# EAGLE design M106A (EAGLE 6.6.0)
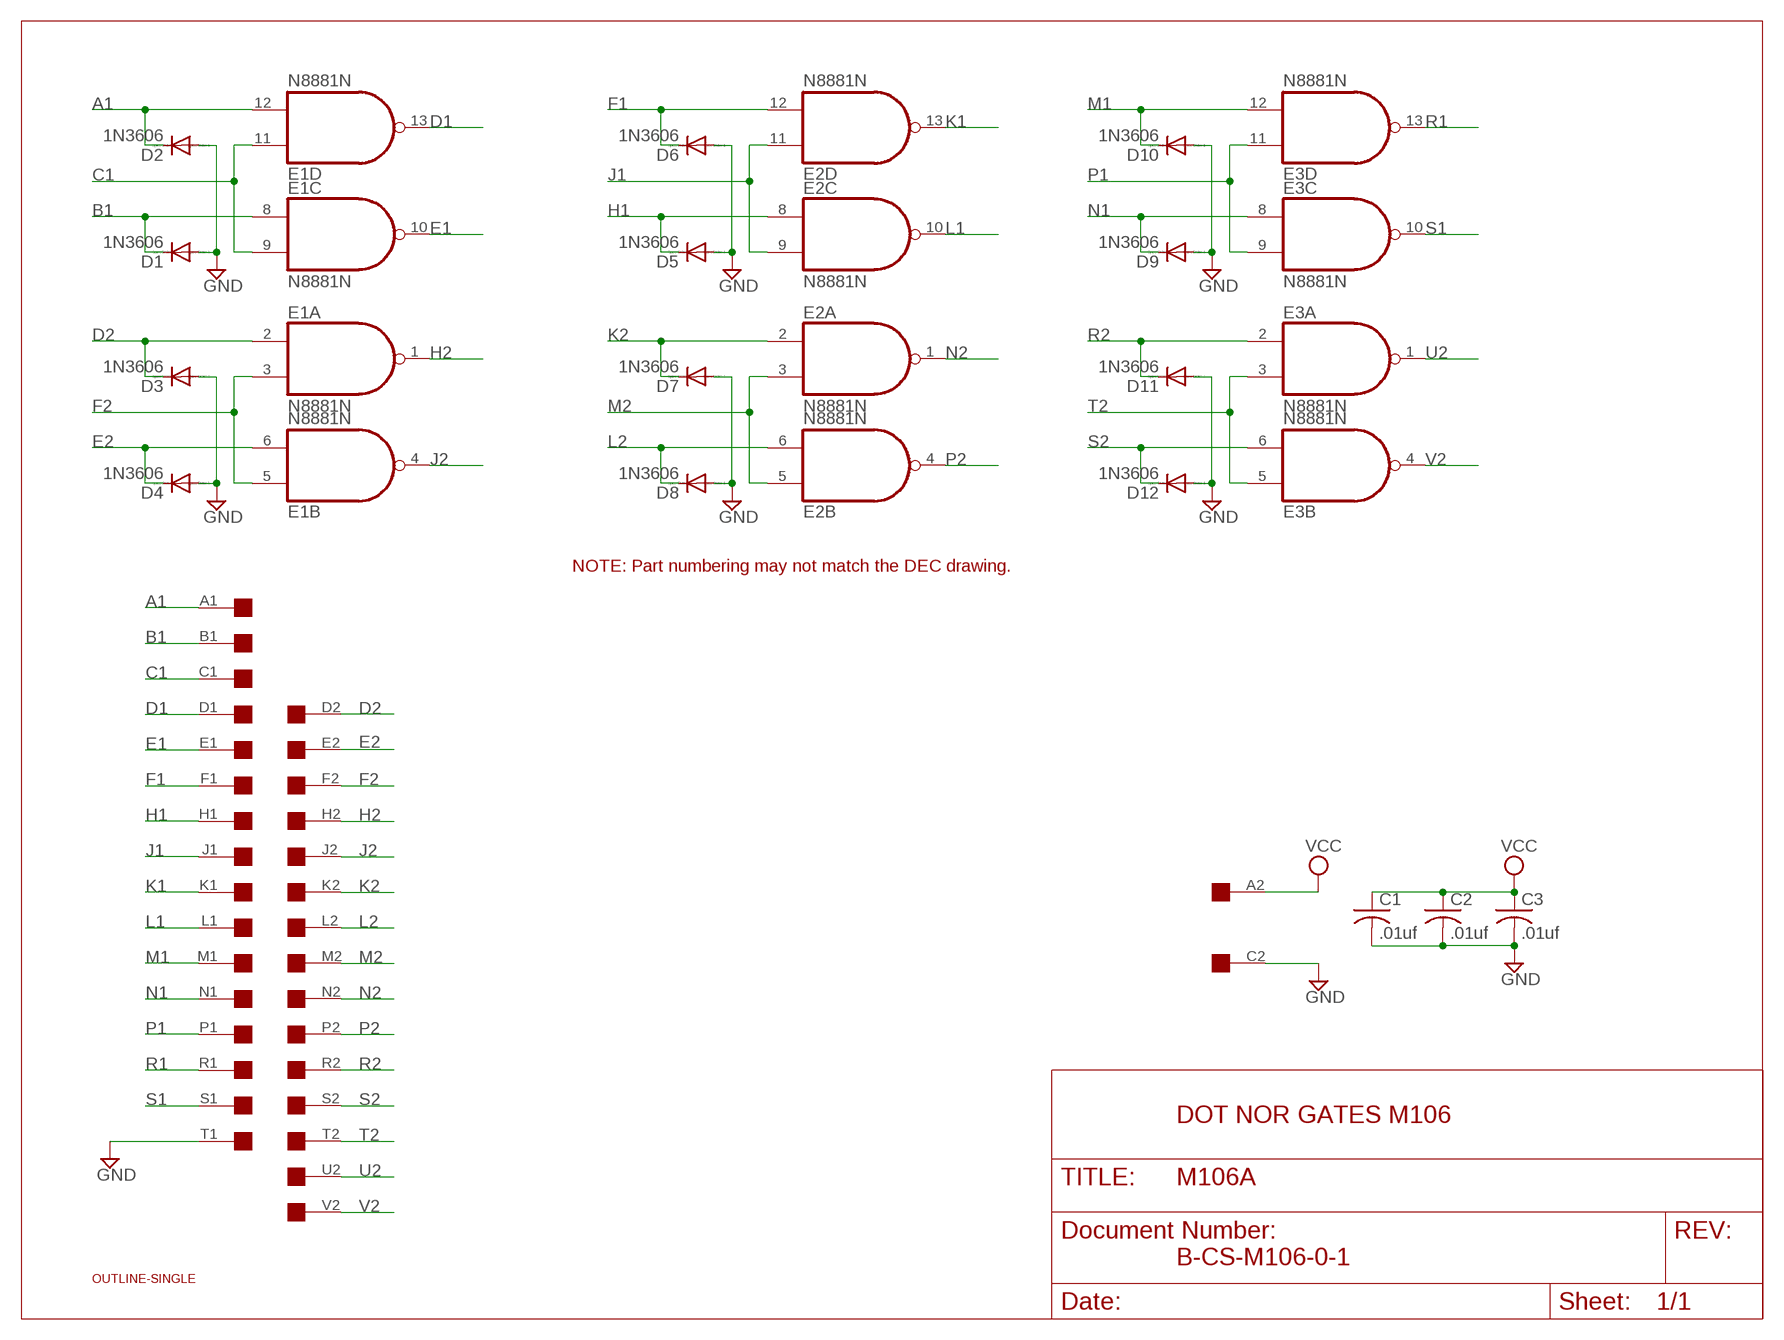
[diagram p0: schematic, sheet 1]

## Parts
C1  .01uf  C-US050-025X075  [C050-025X075]
C2  .01uf  C-US050-025X075  [C050-025X075]
C3  .01uf  C-US050-025X075  [C050-025X075]
D1  1N3606  1N4148DO35-10  [DO35-10]
D2  1N3606  1N4148DO35-10  [DO35-10]
D3  1N3606  1N4148DO35-10  [DO35-10]
D4  1N3606  1N4148DO35-10  [DO35-10]
D5  1N3606  1N4148DO35-10  [DO35-10]
D6  1N3606  1N4148DO35-10  [DO35-10]
D7  1N3606  1N4148DO35-10  [DO35-10]
D8  1N3606  1N4148DO35-10  [DO35-10]
D9  1N3606  1N4148DO35-10  [DO35-10]
D10  1N3606  1N4148DO35-10  [DO35-10]
D11  1N3606  1N4148DO35-10  [DO35-10]
D12  1N3606  1N4148DO35-10  [DO35-10]
E1  N8881N  [DIL14]
E2  N8881N  [DIL14]
E3  N8881N  [DIL14]
U$1  SINGLE  [EDGE-CON2]
U$4  OUTLINE-SINGLE  [SINGLE]

## Nets
A1: D2.C E1.12(D:I1) U$1.A1
B1: D1.C E1.8(C:I0) U$1.B1
C1: E1.9(C:I1) E1.11(D:I0) U$1.C1
D1: E1.13(D:O) U$1.D1
D2: D3.C E1.2(A:I0) U$1.D2
E1: E1.10(C:O) U$1.E1
E2: D4.C E1.6(B:I1) U$1.E2
F1: D6.C E2.12(D:I1) U$1.F1
F2: E1.3(A:I1) E1.5(B:I0) U$1.F2
GND [Supply]: C1.2 C2.2 C3.2 D1.A D2.A D3.A D4.A D5.A D6.A D7.A D8.A D9.A D10.A D11.A D12.A U$1.C2 U$1.T1
H1: D5.C E2.8(C:I0) U$1.H1
H2: E1.1(A:O) U$1.H2
J1: E2.9(C:I1) E2.11(D:I0) U$1.J1
J2: E1.4(B:O) U$1.J2
K1: E2.13(D:O) U$1.K1
K2: D7.C E2.2(A:I0) U$1.K2
L1: E2.10(C:O) U$1.L1
L2: D8.C E2.6(B:I1) U$1.L2
M1: D10.C E3.12(D:I1) U$1.M1
M2: E2.3(A:I1) E2.5(B:I0) U$1.M2
N1: D9.C E3.8(C:I0) U$1.N1
N2: E2.1(A:O) U$1.N2
P1: E3.9(C:I1) E3.11(D:I0) U$1.P1
P2: E2.4(B:O) U$1.P2
R1: E3.13(D:O) U$1.R1
R2: D11.C E3.2(A:I0) U$1.R2
S1: E3.10(C:O) U$1.S1
S2: D12.C E3.6(B:I1) U$1.S2
T2: E3.3(A:I1) E3.5(B:I0) U$1.T2
U2: E3.1(A:O) U$1.U2
V2: E3.4(B:O) U$1.V2
VCC [Supply]: C1.1 C2.1 C3.1 U$1.A2
Unconnected: U$1.B2 U$1.U1 U$1.V1

## Notes on the sheet
- NOTE: Part numbering may not match the DEC drawing.
- DOT NOR GATES M106
- B-CS-M106-0-1

## Power pins joined to a net without a drawn wire
GND: E1.7(P:GND) E2.7(P:GND) E3.7(P:GND)
VCC: E1.14(P:VCC) E2.14(P:VCC) E3.14(P:VCC)

## Library data of the parts
C1-C3 = rcl:C-US: CAPACITOR, American symbol
D1-D12 = diode:1N4148: DIODE high speed (Philips)
E1-E3 = dec-con:N8881: Quad 2-input NAND gate, open collector
U$1 = dec-con:SINGLE: Single-Height DEC board
U$4 = dec-con:OUTLINE-*: Board outlines for DEC boards.

## Net classes
1 Supply: width 0.813 mm

## Board
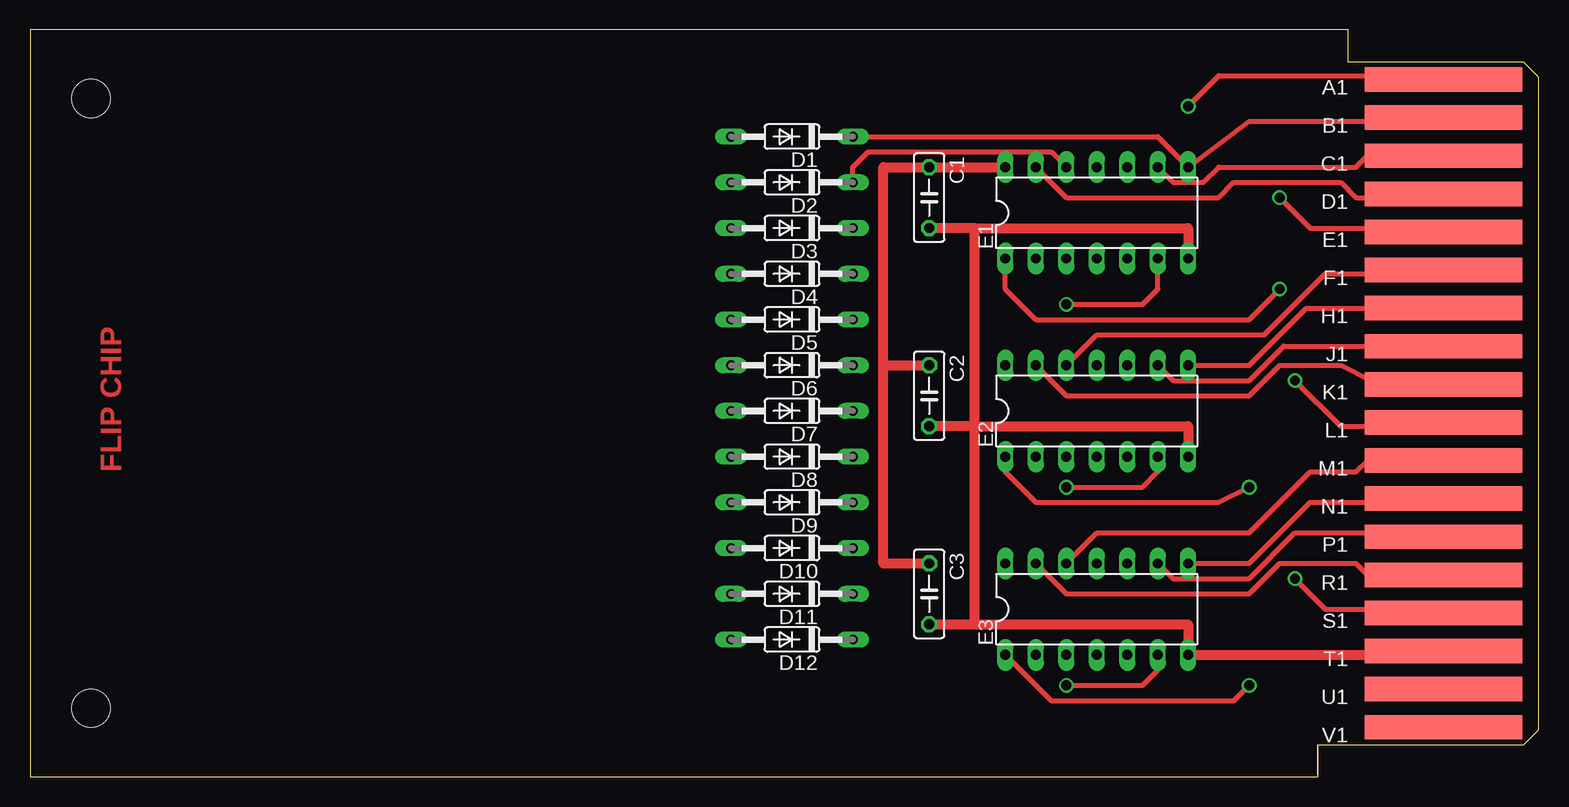
[diagram p1: board, top side]
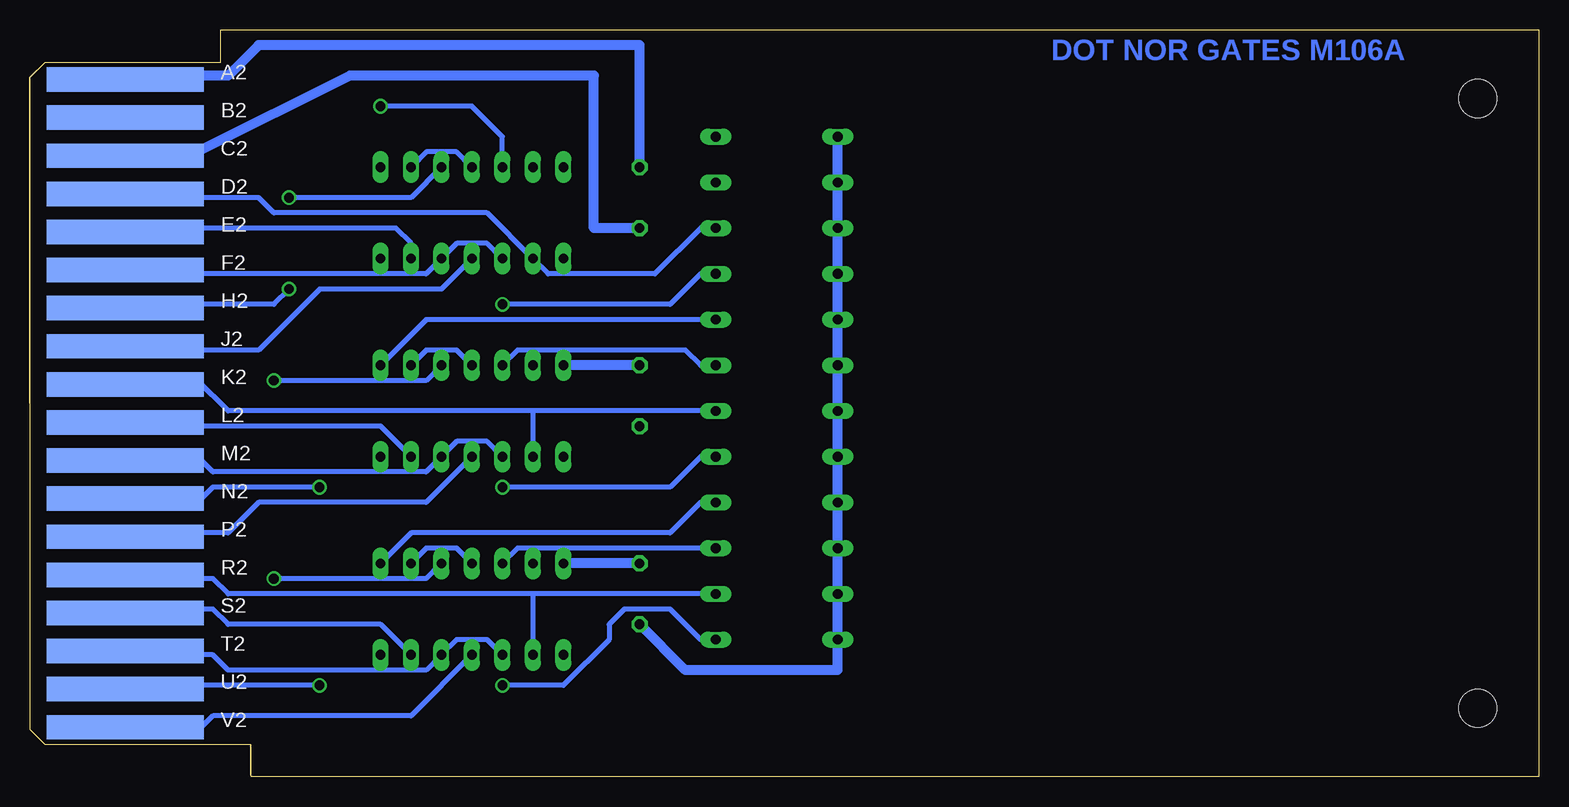
[diagram p2: board, bottom side, seen from below]

Size 125.73 x 62.23 mm. Coordinates in mm from the lower left corner, seen from the top.
Copper layers (1+16): Top 0.035mm / dielectric 1.5mm / Bottom 0.035mm
Design rules "16mils": minimum track width 16mil, minimum drill 32mil, track to track 15mil, track to pad 10mil, pad to pad 10mil, via to via 10mil, smd to smd 10mil, copper to edge 13mil, drill to drill 10mil, minimum pad ring 10mil, minimum via ring 8mil, stop-mask expansion 0mil, vias tented up to drill 0mil, thermal gap 10mil

### Footprints (pad centres in the part's own frame; a part is rotated, then mirrored left to right if it is on the bottom)
C050-025X075 = drill 0.813 octagon: 1 -2.54,0; 2 2.54,0
DO35-10 = drill 0.813 long: A 5.08,0; C -5.08,0
DIL14 = drill 0.813 long: 1 -7.62,-3.81; 2 -5.08,-3.81; 3 -2.54,-3.81; 4 0,-3.81; 5 2.54,-3.81; 6 5.08,-3.81; 7 7.62,-3.81; 8 7.62,3.81; 9 5.08,3.81; 10 2.54,3.81; 11 0,3.81; 12 -2.54,3.81; 13 -5.08,3.81; 14 -7.62,3.81
EDGE-CON2 = smd 13.106 x 2.032: A1 7.938,4.128; B1 7.938,7.303; C1 7.938,10.477; D1 7.938,13.652; E1 7.938,16.828; F1 7.938,20.003; H1 7.938,23.177; J1 7.938,26.352; K1 7.938,29.527; L1 7.938,32.703; M1 7.938,35.877; N1 7.938,39.053; P1 7.938,42.227; R1 7.938,45.403; S1 7.938,48.578; T1 7.938,51.752; U1 7.938,54.928; V1 7.938,58.102 | smd 13.106 x 2.032 bottom: A2 7.938,4.128; B2 7.938,7.303; C2 7.938,10.477; D2 7.938,13.652; E2 7.938,16.828; F2 7.938,20.003; H2 7.938,23.177; J2 7.938,26.352; K2 7.938,29.527; L2 7.938,32.703; M2 7.938,35.877; N2 7.938,39.053; P2 7.938,42.227; R2 7.938,45.403; S2 7.938,48.578; T2 7.938,51.752; U2 7.938,54.928; V2 7.938,58.102
SINGLE = hole 3.175: 120.65,56.515; 120.65,5.715

### Placement (x,y rotation side)
C1  74.93,48.26 270 top
C2  74.93,31.75 270 top
C3  74.93,15.24 270 top
D1  63.5,53.34 180 top
D2  63.5,49.53 180 top
D3  63.5,45.72 180 top
D4  63.5,41.91 180 top
D5  63.5,38.1 180 top
D6  63.5,34.29 180 top
D7  63.5,30.48 180 top
D8  63.5,26.67 180 top
D9  63.5,22.86 180 top
D10  63.5,19.05 180 top
D11  63.5,15.24 180 top
D12  63.5,11.43 180 top
E1  88.9,46.99 0 top
E2  88.9,30.48 0 top
E3  88.9,13.97 0 top
U$1  125.73,62.23 180 top
U$4  125.73,62.23 180 top

### Tracks (layer width: path | path; a pad name or v marks a point on that pad's centre or on a via)
A1  (via drill 0.81)
  Top 0.406: D2.C 68.58,50.8 69.85,52.07 85.09,52.07 E1.12 | U$1.A1 112.16,58.02 111.76,58.42 99.06,58.42 v96.52,55.88
  Bottom 0.406: E1.12 86.36,53.34 88.9,55.88 v96.52,55.88
B1
  Top 0.406: D1.C 93.98,53.34 E1.8 101.6,54.61 111.76,54.61 112.74,54.9 U$1.B1
C1
  Top 0.406: U$1.C1 111.43,51.74 110.49,50.8 99.06,50.8 97.79,49.53 95.25,49.53 E1.9
  Bottom 0.406: E1.11 90.17,52.07 92.71,52.07 E1.9
D1
  Top 0.406: U$1.D1 112.06,48.56 111.76,48.26 110.49,48.26 109.22,49.53 100.33,49.53 99.06,48.26 86.36,48.26 E1.13
D2
  Bottom 0.406: U$1.D2 112.06,48.56 111.76,48.26 106.68,48.26 105.41,46.99 87.63,46.99 E1.2 82.55,41.91 73.66,41.91 69.85,45.72 D3.C
E1  (via drill 0.81)
  Top 0.406: U$1.E1 112.09,45.39 111.76,45.72 106.68,45.72 v104.14,48.26
  Bottom 0.406: v104.14,48.26 93.98,48.26 E1.10
E2  (via drill 0.81)
  Top 0.406: E1.6 93.98,40.64 92.71,39.37 v86.36,39.37
  Bottom 0.406: E1.6 93.98,44.45 95.25,45.72 113.03,45.72 113.36,45.39 U$1.E2 | D4.C 69.85,41.91 72.39,39.37 v86.36,39.37
F1
  Top 0.406: U$1.F1 112.04,42.19 111.76,41.91 107.95,41.91 102.87,36.83 88.9,36.83 E2.12
  Bottom 0.406: D6.C 69.85,34.29 71.12,35.56 85.09,35.56 E2.12
F2
  Bottom 0.406: E1.3 87.63,44.45 90.17,44.45 E1.5 92.71,41.91 111.76,41.91 112.04,42.19 U$1.F2
GND
  Top 0.813: C3.2 78.74,12.7 | 78.74,12.7 78.74,29.21 | 78.74,29.21 78.74,45.72 | 78.74,45.72 C1.2 | 78.74,29.21 C2.2 | U$1.T1 112.09,10.49 111.76,10.16 E3.7 96.52,12.7 78.74,12.7 | E2.7 96.52,29.21 78.74,29.21 | E1.7 96.52,45.72 78.74,45.72
  Bottom 0.813: U$1.C2 111.76,51.74 111.76,52.07 99.06,58.42 78.74,58.42 78.74,45.72 C1.2 | C3.2 71.12,8.89 58.42,8.89 D12.A D11.A D10.A D9.A D8.A D7.A D6.A D5.A D4.A D3.A D2.A D1.A
H1
  Top 0.406: U$1.H1 106.35,39.04 101.6,34.29 E2.8
  Bottom 0.406: D5.C 92.71,38.1 E2.8
H2  (via drill 0.81)
  Top 0.406: E1.1 81.28,40.64 83.82,38.1 101.6,38.1 v104.14,40.64
  Bottom 0.406: U$1.H2 112.09,39.04 111.76,39.37 105.41,39.37 v104.14,40.64
J1
  Top 0.406: U$1.J1 104.47,35.89 101.6,33.02 95.25,33.02 E2.9
  Bottom 0.406: E2.11 90.17,35.56 92.71,35.56 E2.9
J2
  Bottom 0.406: U$1.J2 112.09,35.89 111.76,35.56 106.68,35.56 101.6,40.64 91.44,40.64 E1.4
K1
  Top 0.406: U$1.K1 112.72,32.72 111.76,33.02 109.22,34.29 104.14,34.29 101.6,31.75 86.36,31.75 E2.13
K2
  Bottom 0.406: D7.C 83.82,30.48 | 83.82,30.48 E2.2 | U$1.K2 112.72,32.72 111.76,33.02 109.22,30.48 83.82,30.48
L1  (via drill 0.81)
  Top 0.406: U$1.L1 113.03,29.21 109.22,29.21 v105.41,33.02
  Bottom 0.406: v105.41,33.02 92.71,33.02 E2.10
L2  (via drill 0.81)
  Top 0.406: E2.6 93.98,25.4 92.71,24.13 v86.36,24.13
  Bottom 0.406: v86.36,24.13 72.39,24.13 69.85,26.67 D8.C | U$1.L2 112.09,29.54 111.76,29.21 96.52,29.21 E2.6
M1
  Top 0.406: U$1.M1 111.43,26.34 110.49,25.4 106.68,25.4 101.6,20.32 88.9,20.32 E3.12
  Bottom 0.406: D10.C 85.09,19.05 E3.12
M2
  Bottom 0.406: E2.3 87.63,27.94 90.17,27.94 E2.5 92.71,25.4 110.49,25.4 111.43,26.34 U$1.M2
N1
  Top 0.406: U$1.N1 112.09,23.19 111.76,22.86 106.68,22.86 101.6,17.78 E3.8
  Bottom 0.406: D9.C 69.85,22.86 72.39,20.32 93.98,20.32 E3.8
N2  (via drill 0.81)
  Top 0.406: E2.1 81.28,25.4 83.82,22.86 99.06,22.86 v101.6,24.13
  Bottom 0.406: U$1.N2 111.43,23.19 110.49,24.13 v101.6,24.13
P1
  Top 0.406: U$1.P1 112.09,19.99 111.76,20.32 105.41,20.32 101.6,16.51 95.25,16.51 E3.9
  Bottom 0.406: E3.11 90.17,19.05 92.71,19.05 E3.9
P2
  Bottom 0.406: U$1.P2 112.09,19.99 111.76,20.32 109.22,20.32 106.68,22.86 92.71,22.86 E2.4
R1
  Top 0.406: U$1.R1 111.43,16.84 110.49,17.78 104.14,17.78 101.6,15.24 86.36,15.24 E3.13
R2
  Bottom 0.406: D11.C 83.82,15.24 | 83.82,15.24 E3.2 | 83.82,15.24 109.22,15.24 110.49,16.51 111.76,16.51 112.09,16.84 U$1.R2
S1  (via drill 0.81)
  Top 0.406: U$1.S1 112.06,13.66 111.76,13.97 107.95,13.97 v105.41,16.51
  Bottom 0.406: v105.41,16.51 92.71,16.51 E3.10
S2  (via drill 0.81)
  Top 0.406: E3.6 93.98,8.89 92.71,7.62 v86.36,7.62
  Bottom 0.406: D12.C 69.85,11.43 72.39,13.97 76.2,13.97 77.47,12.7 77.47,11.43 81.28,7.62 v86.36,7.62 | E3.6 96.52,12.7 109.22,12.7 110.49,13.97 111.76,13.97 112.06,13.66 U$1.S2
T2
  Bottom 0.406: E3.3 87.63,11.43 90.17,11.43 E3.5 92.71,8.89 109.22,8.89 110.49,10.16 111.76,10.16 112.09,10.49 U$1.T2
U2  (via drill 0.81)
  Top 0.406: E3.1 85.09,6.35 100.33,6.35 v101.6,7.62
  Bottom 0.406: U$1.U2 112.12,7.26 111.76,7.62 v101.6,7.62
V2
  Bottom 0.406: U$1.V2 111.37,4.2 110.49,5.08 93.98,5.08 E3.4
VCC
  Top 0.813: 71.12,34.29 71.12,17.78 C3.1 | 71.12,34.29 71.12,50.8 C1.1 E1.14 | 71.12,34.29 C2.1
  Bottom 0.813: U$1.A2 113.03,58.02 111.76,58.42 109.22,58.42 106.68,60.96 74.93,60.96 C1.1 | C2.1 E2.14 | C3.1 E3.14

### Text on the board
Top: FLIP CHIP
Bottom: DOT NOR GATES M106A